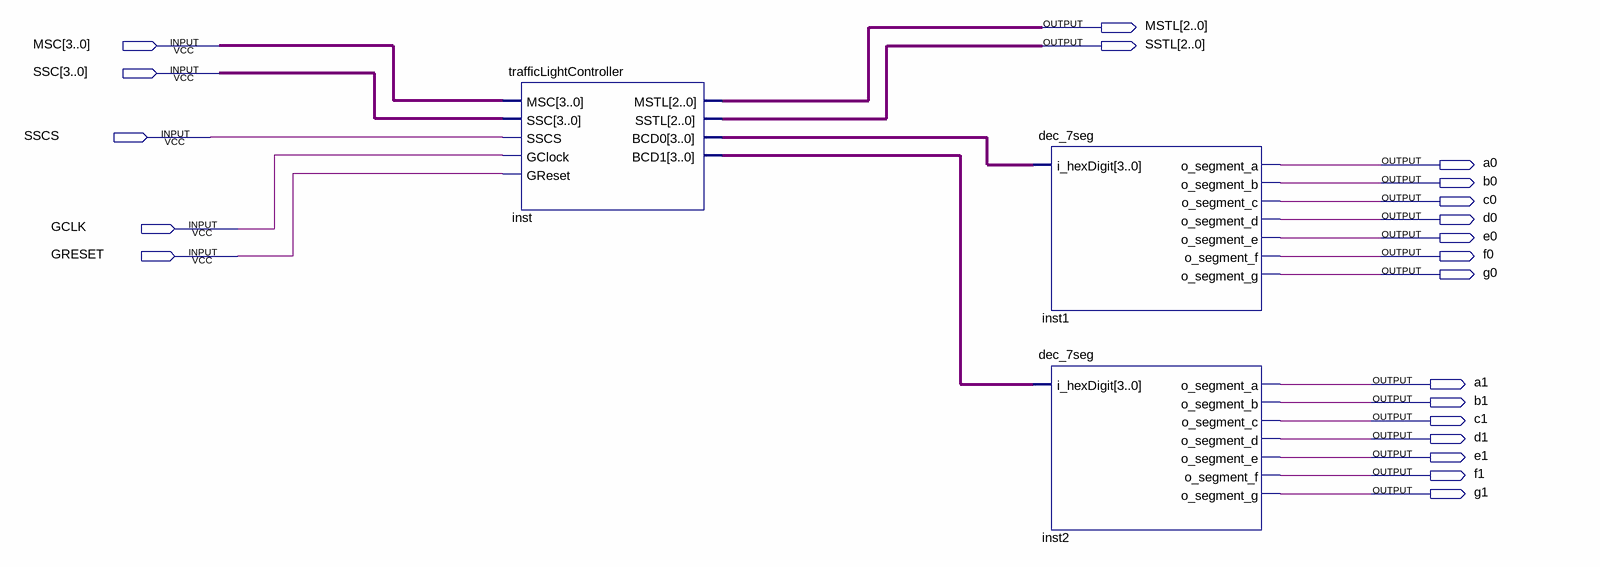
[diagram p0: schematic sheet]
// Quartus schematic TOP.bdf as structural Verilog: 3 symbols, 21 pins
module TOP (
  input  [3:0] MSC,
  input  [3:0] SSC,
  input  SSCS,
  input  GCLK,
  input  GRESET,
  output [2:0] MSTL,
  output [2:0] SSTL,
  output a0,
  output b0,
  output c0,
  output d0,
  output e0,
  output f0,
  output g0,
  output a1,
  output b1,
  output c1,
  output d1,
  output e1,
  output f1,
  output g1
);

  wire [3:0] inst_bcd0, inst_bcd1;

  trafficLightController inst (
    .MSC(MSC), .SSC(SSC), .SSCS(SSCS), .GClock(GCLK), .GReset(GRESET), .MSTL(MSTL), .SSTL(SSTL),
    .BCD0(inst_bcd0), .BCD1(inst_bcd1));
  dec_7seg inst1 (
    .i_hexDigit(inst_bcd0), .o_segment_a(a0), .o_segment_b(b0), .o_segment_c(c0), .o_segment_d(d0),
    .o_segment_e(e0), .o_segment_f(f0), .o_segment_g(g0));
  dec_7seg inst2 (
    .i_hexDigit(inst_bcd1), .o_segment_a(a1), .o_segment_b(b1), .o_segment_c(c1), .o_segment_d(d1),
    .o_segment_e(e1), .o_segment_f(f1), .o_segment_g(g1));
endmodule
